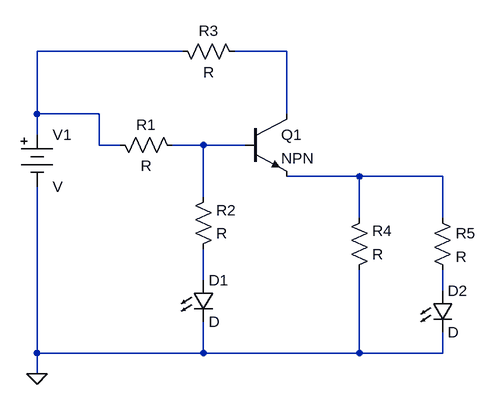
[diagram p0: schematic Draft2.asc]
Draft2.asc, the LTspice schematic file:
Version 4
SHEET 1 880 680
WIRE 192 -32 -32 -32
WIRE 352 -32 272 -32
WIRE -32 64 -32 -32
WIRE 64 64 -32 64
WIRE 352 64 352 -32
WIRE -32 96 -32 64
WIRE 64 112 64 64
WIRE 96 112 64 112
WIRE 224 112 176 112
WIRE 288 112 224 112
WIRE 464 160 352 160
WIRE 592 160 464 160
WIRE 224 192 224 112
WIRE 464 224 464 160
WIRE 592 224 592 160
WIRE 224 320 224 272
WIRE 592 336 592 304
WIRE -32 432 -32 176
WIRE 224 432 224 384
WIRE 224 432 -32 432
WIRE 464 432 464 304
WIRE 464 432 224 432
WIRE 592 432 592 400
WIRE 592 432 464 432
WIRE -32 464 -32 432
FLAG -32 464 0
SYMBOL Misc\\battery -32 80 R0
SYMATTR InstName V1
SYMBOL npn2 288 64 R0
SYMATTR InstName Q1
SYMBOL res 192 128 M270
WINDOW 0 32 56 VTop 2
WINDOW 3 0 56 VBottom 2
SYMATTR InstName R1
SYMBOL res 208 288 M180
WINDOW 0 36 76 Left 2
WINDOW 3 36 40 Left 2
SYMATTR InstName R2
SYMBOL res 288 -16 M270
WINDOW 0 32 56 VTop 2
WINDOW 3 0 56 VBottom 2
SYMATTR InstName R3
SYMBOL res 448 320 M180
WINDOW 0 36 76 Left 2
WINDOW 3 36 40 Left 2
SYMATTR InstName R4
SYMBOL res 576 208 R0
SYMATTR InstName R5
SYMBOL LED 208 320 R0
SYMATTR InstName D1
SYMBOL LED 576 336 R0
SYMATTR InstName D2

The netlist it stands for:
* Draft2.asc
V1 N001 0 V
Q1 N002 N003 N004 0 NPN
R1 N003 N001 R
R2 N005 N003 R
R3 N002 N001 R
R4 0 N004 R
R5 N004 N006 R
D1 N005 0 D
D2 N006 0 D
.model D D
.lib standard.dio
.model NPN NPN
.model PNP PNP
.lib standard.bjt
.backanno
.end